# Altium schematic sheet isolation-buffers.SchDoc
size B; SheetNumber: 5; SheetTotal: 5
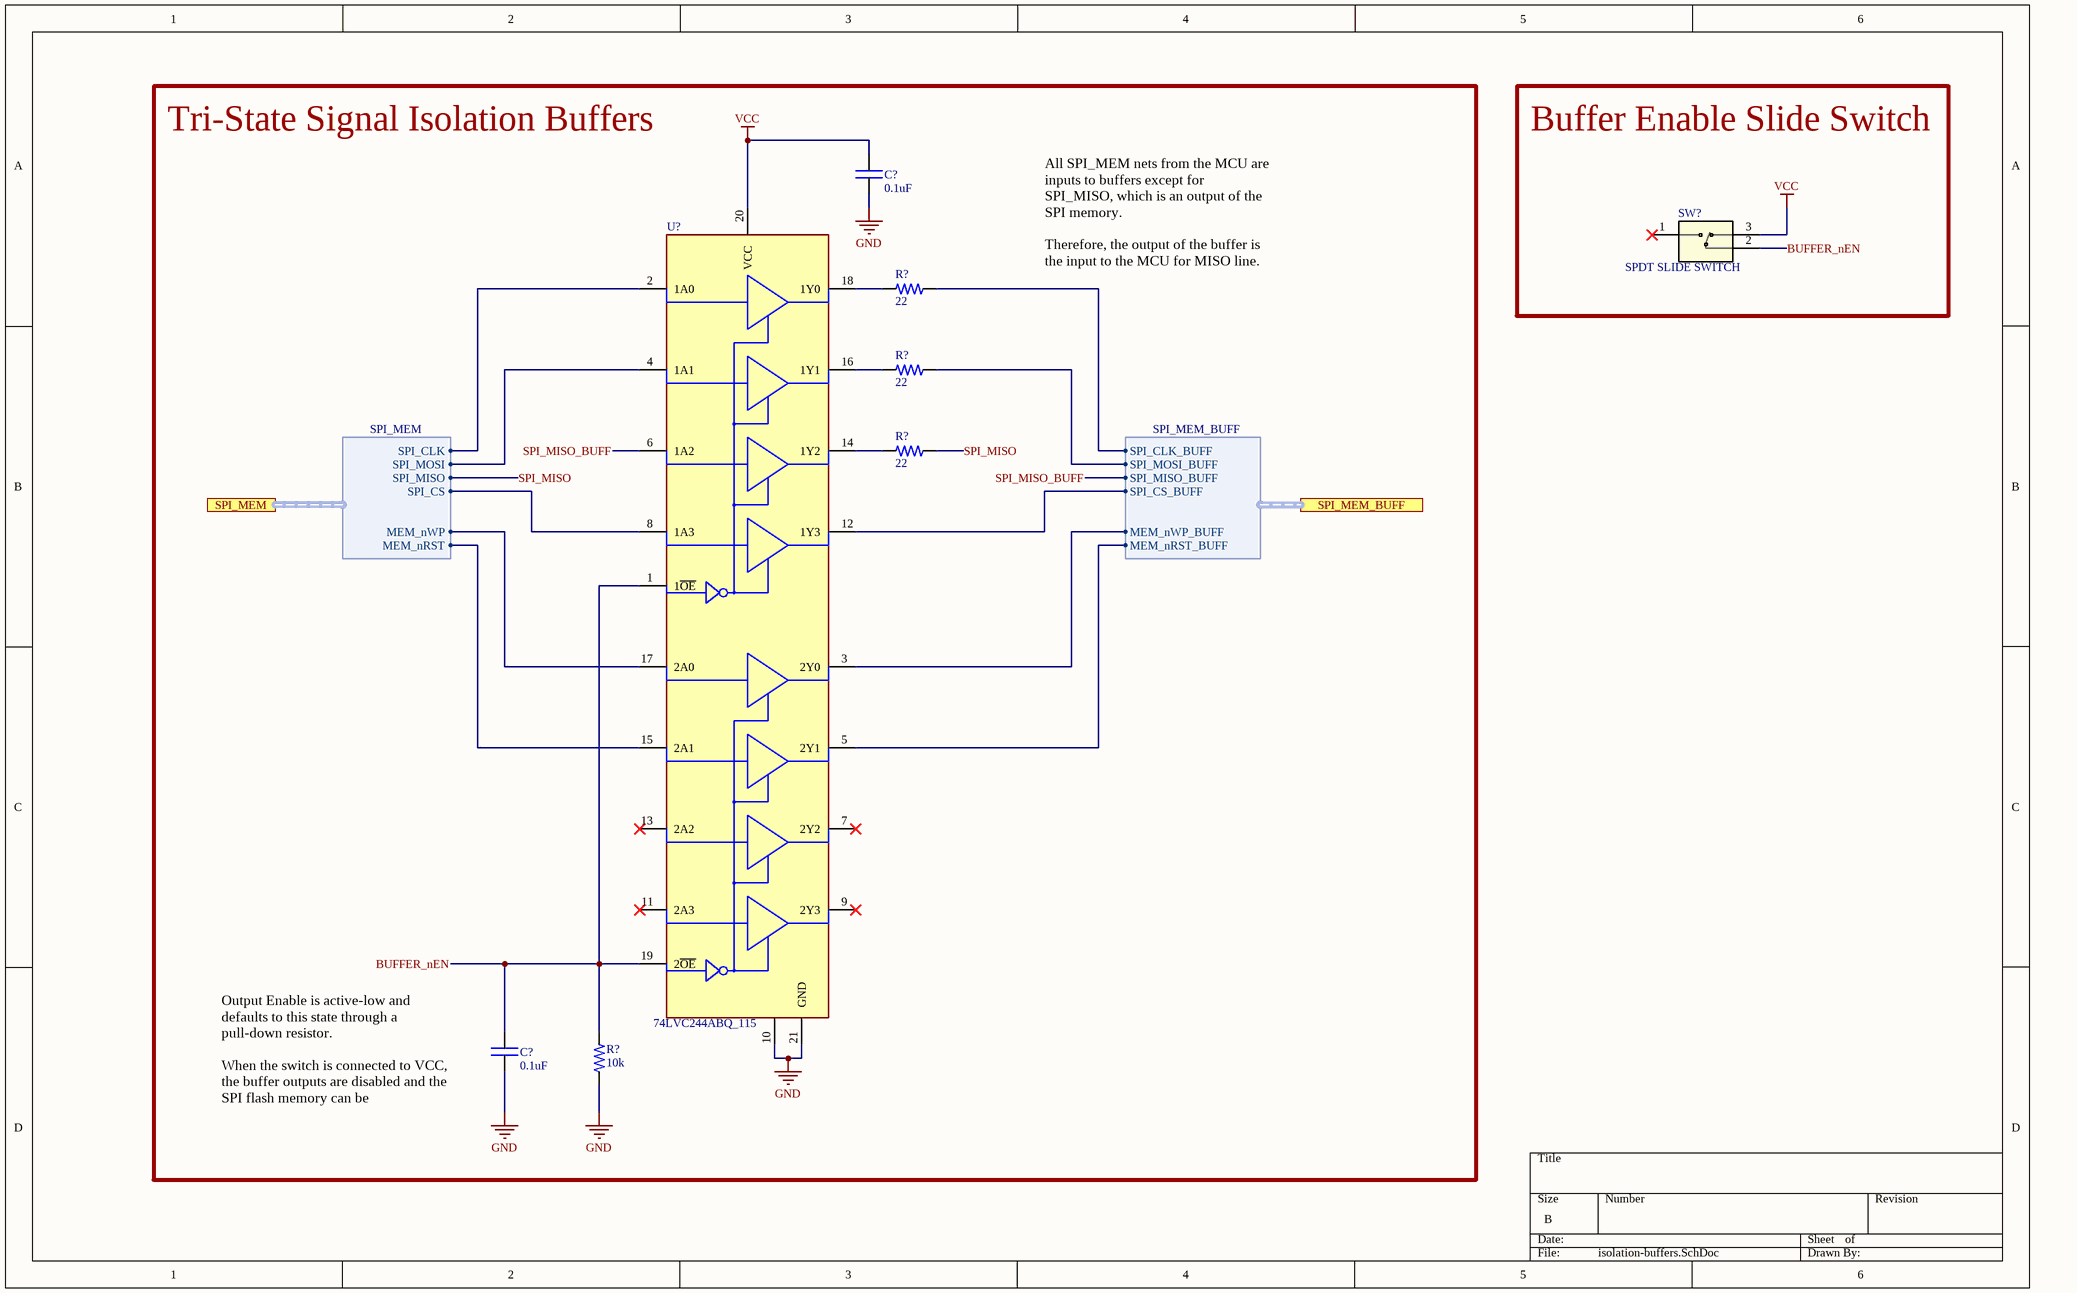
[diagram p0: isolation-buffers.SchDoc]

## Parts
(Parts that share a designator on the sheet are numbered #1, #2 ... from top to bottom, then left to right.)
C?#1  value 0.1uF  [0402C]  (hidden comment: CAP)
C?#2  value 0.1uF  [0402C]  (hidden comment: CAP)
R?#1  value 22  [0402R]  (hidden comment: RES)
R?#2  value 22  [0402R]  (hidden comment: RES)
R?#3  value 22  [0402R]  (hidden comment: RES)
R?#4  value 10k  [0402R]  (hidden comment: RES)
SW?  SPDT SLIDE SWITCH
U?  74LVC244ABQ_115  [20-VFQN-EP]

## Blocks framed on the sheet
Tri-State Signal Isolation Buffers: C?#1 C?#2 R?#1-R?#4 U?
Buffer Enable Slide Switch: SW?

## Ports
SPI_MEM (harness SPI_MEM), SPI_MEM_BUFF (harness SPI_MEM_BUFF)

## Harnesses
SPI_MEM: SPI_CLK, SPI_MISO, SPI_MOSI, SPI_CS, MEM_nWP, MEM_nRST
SPI_MEM_BUFF: SPI_CLK_BUFF, SPI_MISO_BUFF, SPI_MOSI_BUFF, SPI_CS_BUFF, MEM_nWP_BUFF, MEM_nRST_BUFF

## Nets
GND: C?#1.2 C?#2.1 R?#4.1 U?.10(GND) U?.21(GND)
VCC: C?#1.1 SW?.3 U?.20(VCC)
BUFFER_nEN: C?#2.2 R?#4.2 SW?.2 U?.1(1~{OE}) U?.19(2~{OE})
SPI_MISO: R?#3.1 ; port SPI_MEM.SPI_MISO
SPI_MISO_BUFF: U?.6(1A2) ; port SPI_MEM_BUFF.SPI_MISO_BUFF
NetR?#1_1: R?#1.1 ; port SPI_MEM_BUFF.SPI_CLK_BUFF
NetR?#1_2: R?#1.2 U?.18(1Y0)
NetR?#2_1: R?#2.1 ; port SPI_MEM_BUFF.SPI_MOSI_BUFF
NetR?#2_2: R?#2.2 U?.16(1Y1)
NetR?#3_2: R?#3.2 U?.14(1Y2)
NetU?_2: U?.2(1A0) ; port SPI_MEM.SPI_CLK
NetU?_3: U?.3(2Y0) ; port SPI_MEM_BUFF.MEM_nWP_BUFF
NetU?_4: U?.4(1A1) ; port SPI_MEM.SPI_MOSI
NetU?_5: U?.5(2Y1) ; port SPI_MEM_BUFF.MEM_nRST_BUFF
NetU?_8: U?.8(1A3) ; port SPI_MEM.SPI_CS
NetU?_12: U?.12(1Y3) ; port SPI_MEM_BUFF.SPI_CS_BUFF
NetU?_15: U?.15(2A1) ; port SPI_MEM.MEM_nRST
NetU?_17: U?.17(2A0) ; port SPI_MEM.MEM_nWP

Not connected (* = marked no-connect by the designer): SW? 1*; U? 7(2Y2)* 9(2Y3)* 11(2A3)* 13(2A2)*

## Notes on the sheet
- All SPI_MEM nets from the MCU are inputs to buffers except for SPI_MISO, which is an output of the SPI memory.
  Therefore, the output of the buffer is the input to the MCU for MISO line.
- Output Enable is active-low and defaults to this state through a pull-down resistor.
  When the switch is connected to VCC, the buffer outputs are disabled and the SPI flash memory can be programmed.

## Library data of the parts
C?#1 C?#2 = CAP: Capacitor; Type: SMD; MFR: *; MFR PN: *; Vendor: *; Vendor PN: *; Vendor Link: *
R?#1-R?#4 = RES: Resistor; MFR PN: *; MFR: *; Vendor: *; Vendor PN: *; Vendor Link: *
U? = TRI-STATE BUFFERS 8 CIRC: NXP 74LVC244ABQ,115 Octal Buffer & Line Driver, 3-State, 1.2  3.6 V, 20-Pin DHVQFN; MFR: Nexperia; MFR PN: 74LVC244ABQ,115; Value: 74LVC244ABQ,115; Type: SMD